# Altium schematic sheet Connector.SchDoc
size A; Organization: Cal Poly Racing; engineer1: who?
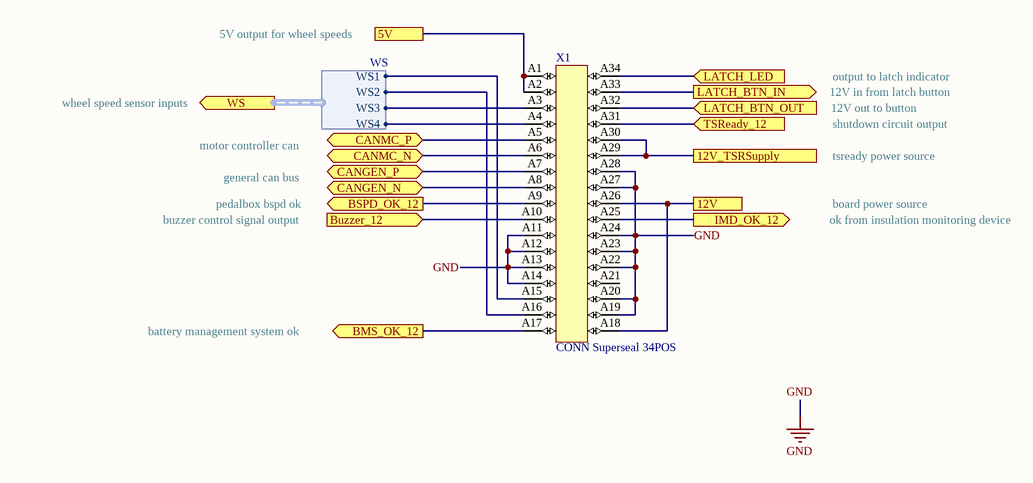
[diagram p0: Connector.SchDoc]

## Parts
X1  CONN Superseal 34POS  [Superseal 34POS]

## Ports
5V, 12V, 12V_TSRSupply, BMS_OK_12 (out), BSPD_OK_12 (out), Buzzer_12 (in), CANGEN_N (bidir), CANGEN_P (bidir), CANMC_N (bidir), CANMC_P (bidir), IMD_OK_12 (out), LATCH_BTN_IN (out), LATCH_BTN_OUT (in), LATCH_LED (in), TSReady_12 (in), WS (out, harness WS)

## Harnesses
WS: WS1, WS2, WS3, WS4

## Nets
GND: X1.A11 X1.A12 X1.A13 X1.A14 X1.A19 X1.A20 X1.A22 X1.A23 X1.A24 X1.A27 X1.A28
5V: X1.A1 X1.A2 ; port 5V
12V: X1.A18 X1.A26 ; port 12V
12V_TSRSupply: X1.A29 X1.A30 ; port 12V_TSRSupply
BMS_OK_12: X1.A17 ; port BMS_OK_12
BSPD_OK_12: X1.A9 ; port BSPD_OK_12
Buzzer_12: X1.A10 ; port Buzzer_12
CANGEN_N: X1.A8 ; port CANGEN_N
CANGEN_P: X1.A7 ; port CANGEN_P
CANMC_N: X1.A6 ; port CANMC_N
CANMC_P: X1.A5 ; port CANMC_P
IMD_OK_12: X1.A25 ; port IMD_OK_12
LATCH_BTN_IN: X1.A33 ; port LATCH_BTN_IN
LATCH_BTN_OUT: X1.A32 ; port LATCH_BTN_OUT
LATCH_LED: X1.A34 ; port LATCH_LED
TSReady_12: X1.A31 ; port TSReady_12
NetX1_A3: X1.A3 ; port WS.WS3
NetX1_A4: X1.A4 ; port WS.WS4
NetX1_A15: X1.A15 ; port WS.WS1
NetX1_A16: X1.A16 ; port WS.WS2

Not connected (* = marked no-connect by the designer): X1 A21

## Notes on the sheet
- 5V output for wheel speeds
- output to latch indicator
- wheel speed sensor inputs
- motor controller can
- tsready power source
- shutdown circuit output
- 12V out to button
- 12V in from latch button
- pedalbox bspd ok
- general can bus
- buzzer control signal output
- board power source
- ok from insulation monitoring device
- battery management system ok
- Date:
- Time:
- File:

## Library data of the parts
X1 = 11: AMP Superseal 34 POS; id: 11; name: 6437288-1; numcontacts: 34; numrows: 4; pitch: 3mm; quantity: 0; link: https://www.digikey.com/products/en?mpart=6437288-1&&csp=WT.z_cid%3Dsp_8004_20120425_buynow%26TE_cid%3D8004-1541898693362